# EAGLE schematic gate_schematic (EAGLE 9.4.1)
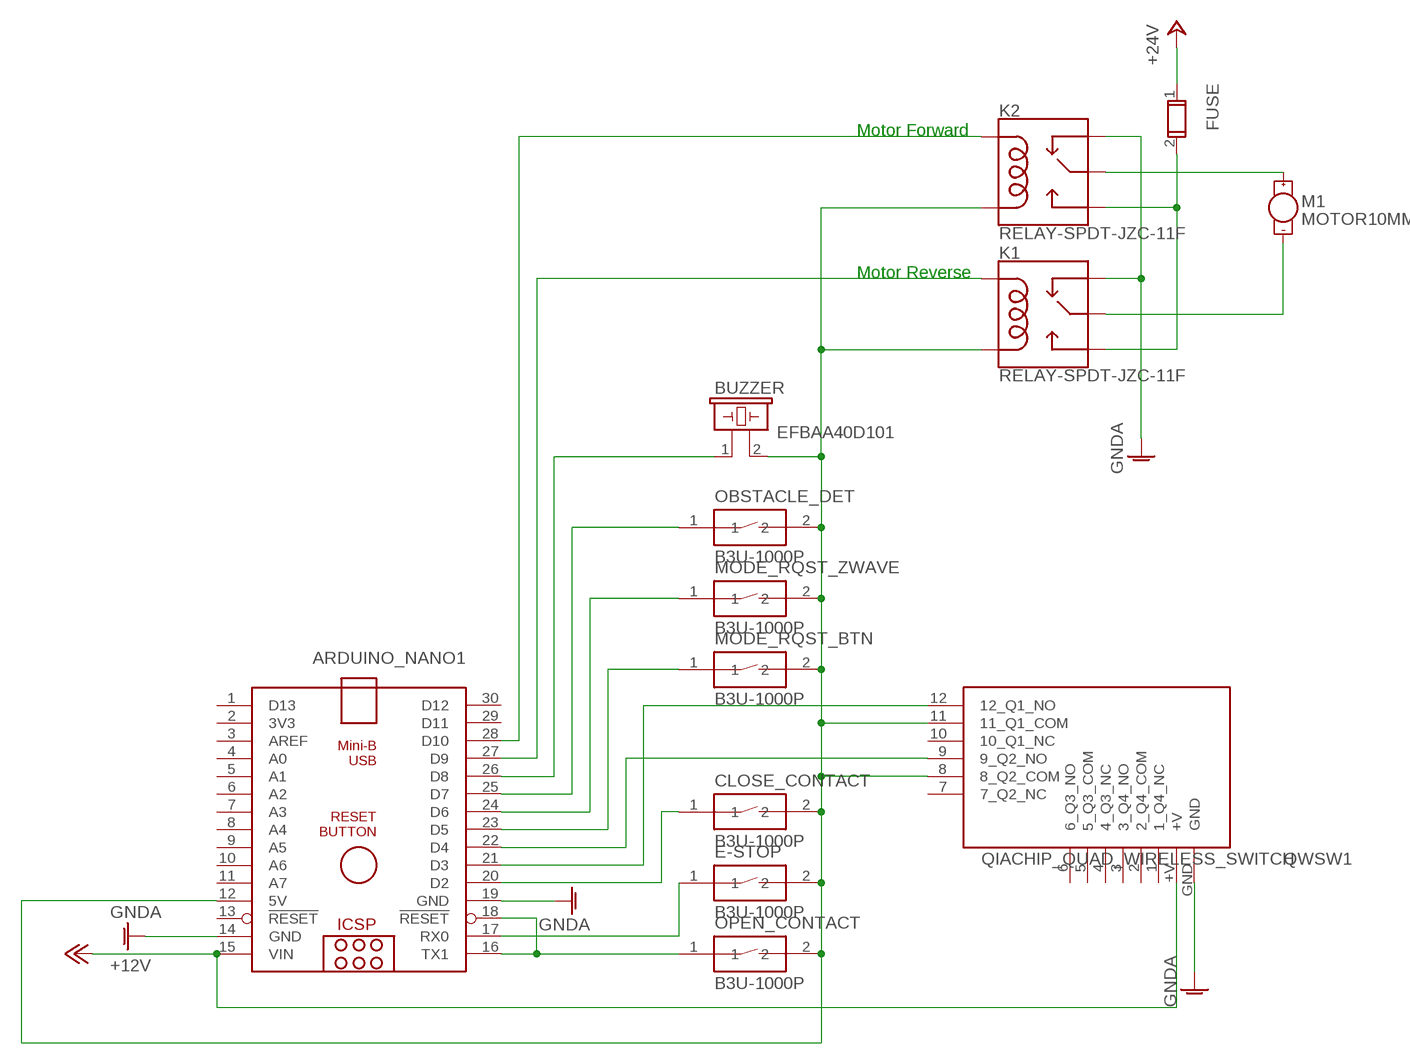
[diagram p0: schematic, sheet 1]

## Parts
ARDUINO_NANO1  ARDUINO_NANO  [ARDUINO_NANO]
BUZZER  EFBAA40D101  [EFBAA40D101]
CLOSE_CONTACT  B3U-1000P  [B3U-1000P]
E-STOP  B3U-1000P  [B3U-1000P]
FUSE  696106003002  [696106003002]
K1  RELAY-SPDT-JZC-11F  [RELAY-JZC]
K2  RELAY-SPDT-JZC-11F  [RELAY-JZC]
M1  MOTOR10MM  [VIBE-MOTOR-10MM]
MODE_RQST_BTN  B3U-1000P  [B3U-1000P]
MODE_RQST_ZWAVE  B3U-1000P  [B3U-1000P]
OBSTACLE_DET  B3U-1000P  [B3U-1000P]
OPEN_CONTACT  B3U-1000P  [B3U-1000P]
QWSW1  QIACHIP_QUAD_WIRELESS_SWITCH  [QIACHIP_QUAD_WIRELESS_SWITCH]

## Nets
+12V: ARDUINO_NANO1.15(VIN) QWSW1.+V
+24V: FUSE.1
GNDA: ARDUINO_NANO1.14(GND) ARDUINO_NANO1.19(GND) K1.2(NC) K2.2(NC) QWSW1.GND
N$1: ARDUINO_NANO1.17(RX0) E-STOP.1
N$2: ARDUINO_NANO1.21(D3) QWSW1.12(12_Q1_NO)
N$3: ARDUINO_NANO1.16(TX1) ARDUINO_NANO1.18(!RESET) OPEN_CONTACT.1
N$4: ARDUINO_NANO1.20(D2) CLOSE_CONTACT.1
N$5: ARDUINO_NANO1.22(D4) QWSW1.9(9_Q2_NO)
N$6: ARDUINO_NANO1.23(D5) MODE_RQST_BTN.1
N$7: ARDUINO_NANO1.24(D6) MODE_RQST_ZWAVE.1
N$8: ARDUINO_NANO1.25(D7) OBSTACLE_DET.1
N$9: ARDUINO_NANO1.26(D8) BUZZER.1
N$10: ARDUINO_NANO1.28(D10) K2.5(COIL1)
N$11: ARDUINO_NANO1.12(5V) BUZZER.2 CLOSE_CONTACT.2 E-STOP.2 K1.1(COIL2) K2.1(COIL2) MODE_RQST_BTN.2 MODE_RQST_ZWAVE.2 OBSTACLE_DET.2 OPEN_CONTACT.2 QWSW1.8(8_Q2_COM) QWSW1.11(11_Q1_COM)
N$12: ARDUINO_NANO1.27(D9) K1.5(COIL1)
N$13: K1.4(MAIN) M1.-
N$14: K2.4(MAIN) M1.+
N$15: FUSE.2 K1.3(NO) K2.3(NO)
Unconnected: ARDUINO_NANO1.1(D13) ARDUINO_NANO1.2(3V3) ARDUINO_NANO1.3(AREF) ARDUINO_NANO1.4(A0) ARDUINO_NANO1.5(A1) ARDUINO_NANO1.6(A2) ARDUINO_NANO1.7(A3) ARDUINO_NANO1.8(A4) ARDUINO_NANO1.9(A5) ARDUINO_NANO1.10(A6) ARDUINO_NANO1.11(A7) ARDUINO_NANO1.13(!RESET) ARDUINO_NANO1.29(D11) ARDUINO_NANO1.30(D12) QWSW1.1(1_Q4_NC) QWSW1.2(2_Q4_COM) QWSW1.3(3_Q4_NO) QWSW1.4(4_Q3_NC) QWSW1.5(5_Q3_COM) QWSW1.6(6_Q3_NO) QWSW1.7(7_Q2_NC) QWSW1.10(10_Q1_NC)

## Notes on the sheet
- Motor Forward
- Motor Reverse

## Library data of the parts
ARDUINO_NANO1 = ArduinoNanoV30:ARDUINO_NANO: Arduino Nano V3.0 Overview: The Arduino Nano is a small, complete, and breadboard-friendly board based on the ATmega328 (Arduino Nano 3.x) or ATmega168 (Arduino Nano 2.x). It has more or less the same functionality of the Arduino Duemilanove, but in a different package. It lacks only a DC power jack, and works with a Mini-B USB cable instead of a standard one. The Nano was designed and is being produced by Gravitech. Specifications: Microcontroller Atmel ATmega168 or ATmega328 Operating Voltage (logic level) 5 V Input Voltage (recommended) 7-12 V Input Voltage (limits) 6-20 V Digital I/O Pins 14 (of which 6 provide PWM output) Analog Input Pins 8 DC Current per I/O Pin 40 mA Flash Memory 16 KB (ATmega168) or 32 KB (ATmega328) of which 2 KB used by bootloader SRAM 1 KB (ATmega168) or 2 KB (ATmega328) EEPROM 512 bytes (ATmega168) or 1 KB (ATmega328) Clock Speed 16 MHz Dimensions 0.73" x 1.70" Length 45 mm Width 18 mm Weigth 5 g Power: The Arduino Nano can be powered via the Mini-B USB connection, 6-20V unregulated external power supply (pin 30), or 5V regulated external power supply (pin 27). The power source is automatically selected to the highest voltage source. Memory: The ATmega168 has 16 KB of flash memory for storing code (of which 2 KB is used for the bootloader); the ATmega328 has 32 KB, (also with 2 KB used for the bootloader). The ATmega168 has 1 KB of SRAM and 512 bytes of EEPROM (which can be read and written with the EEPROM library); the ATmega328 has 2 KB of SRAM and 1 KB of EEPROM. Input and Output: Each of the 14 digital pins on the Nano can be used as an input or output, using pinMode(), digitalWrite(), and digitalRead() functions. They operate at 5 volts. Each pin can provide or receive a maximum of 40 mA and has an internal pull-up resistor (disconnected by default) of 20-50 kOhms. In addition, some pins have specialized functions. Visit Arduino - ArduinoBoardNano <https://www.arduino.cc/en/Main/ArduinoBoardNano>
BUZZER = buzzer:EFB?: Piezoelectric Acoustic Transducer Source: Panbasonic .. 2SC1685.pdf; OC_FARNELL: unknown; OC_NEWARK: unknown
CLOSE_CONTACT E-STOP MODE_RQST_BTN MODE_RQST_ZWAVE OBSTACLE_DET OPEN_CONTACT = Switch:B3U-1000P: SWITCH TACTILE SPST-NO 0.05A 12V; CREATED_BY: PACBLAYOUT; DIGI_KEY_PART_NUMBER: SW1020CT-ND; MANUFACTURER: Omron Electronics Inc-EMC Div; MPN: B3U-1000P; PACKAGE: SPST-NO
FUSE = Wurth_Elektronik_Electromechanic_Fuse_Holder_Connectors_rev16c:696106003002: WR-FSH PTF/76 FUSEHOLDER BLOCKS - PCB - CLIP COVER - THT ;=>Code : Con_FSH_Blocks_696106003002_696106003002 <http://katalog.we-online.de/media/images/eican/Con_FSH_Blocks_696106003002_pf2.jpg> Details see: http://katalog.we-online.de/em/datasheet/696106003002.pdf Created 2014-10-08, Karrer Zheng 2014 (C) Wurth Elektronik
K1 K2 = SparkFun-Electromechanical:RELAY-SPDT: SPDT Electromechanical Relay Single-pole, double-throw sealed relays. When current is applied to the coil, it throws a simple changeover switch, terminating the connection from the NC contact to ground and closing the NO contact. Use them to switch high voltage/high current devices. SparkFun Products JQX-15F: Relay SPDT Sealed - 20A <https://www.sparkfun.com/products/10924> (COM-10924) JZC-11F: Relay SPDT Sealed <https://www.sparkfun.com/products/100> (COM-00100); PROD_ID: COMP-09533; SF_SKU: COM-00100
M1 = SparkFun-Electromechanical:MOTOR: Motor (Single-Phase) Two-terminal, single-phase motors. SparkFun Products Vibration Motor <https://www.sparkfun.com/products/8449> (ROB-08449) Physical dimension and wire connections for this powerful vibration motor. Motor has a self adhesive backing.; PROD_ID: COMP-08572; SF_SKU: ROB-08449
QWSW1 = gateCustomPartLibrary:QIACHIP_QUAD_WIRELESS_SWITCH